# EAGLE design temp_sensor (EAGLE 9.1.3)
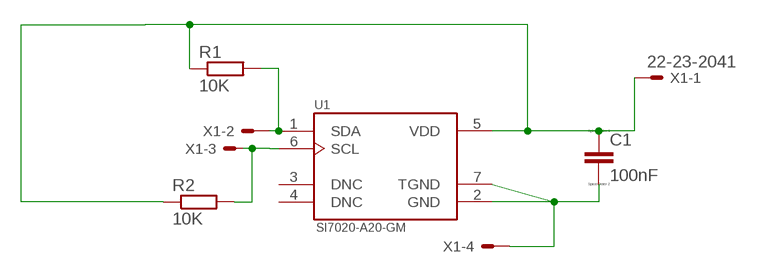
[diagram p0: schematic, sheet 1]

## Parts
C1  100nF  CC0603  [C0603]
R1  10K  R-EU_R0402  [R0402]
R2  10K  R-EU_R0402  [R0402]
U1  SI7020-A20-GM  [SON100P300X300X80-7N]
X1  22-23-2041  [22-23-2041]

## Nets
GND: C1.2 U1.2(GND) U1.7(TGND) X1.4
SCL: R2.2 U1.6(SCL) X1.3
SDA: R1.2 U1.1(SDA) X1.2
VDD: C1.1 R1.1 R2.1 U1.5(VDD) X1.1
Unconnected: U1.3(DNC) U1.4(DNC)

## Library data of the parts
C1 = eagle-ltspice:C: CAPACITOR, European symbol; SPICEMODEL: NONE; SPICEPREFIX: C
R1 R2 = rcl:R-EU_: RESISTOR, European symbol; SPICEPREFIX: R
U1 = SI7020-A20-GM:SI7020-A20-GM: Digital Temperature/Humidity Sensor 6-Pin DFN T/R Check availability <https://pricing.snapeda.com/parts/SI7020-A20-GM/Silicon%20Labs/view-part?ref=eda>; AVAILABILITY: In Stock; DESCRIPTION: Humidity Temperature Sensor 0 ~ 100% RH I²C ±4% RH 18 s Surface Mount; MF: Silicon Labs; MP: SI7020-A20-GM; PACKAGE: DFN-6 Silicon Labs; PRICE: None; PURCHASE-URL: https://pricing.snapeda.com/search/part/SI7020-A20-GM/?ref=eda
X1 = con-molex:22-23-2041: .100" (2.54mm) Center Header - 4 Pin; MF: MOLEX; MPN: 22-23-2041; OC_FARNELL: 1462920; OC_NEWARK: 38C0355

## Board
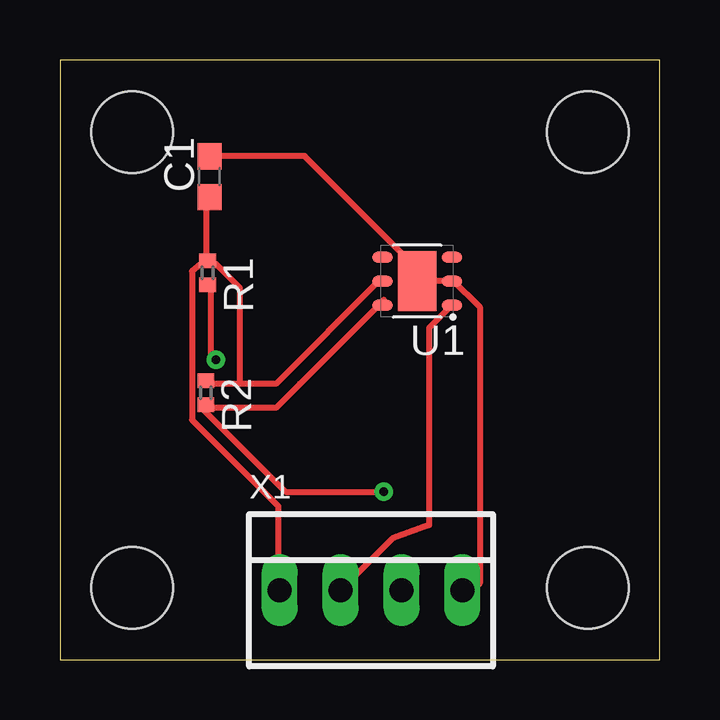
[diagram p1: board, top side]
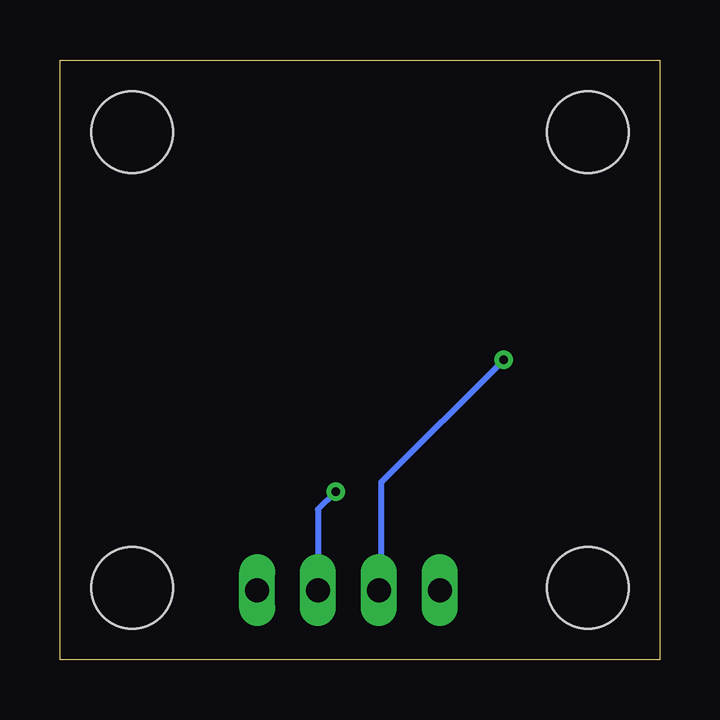
[diagram p2: board, bottom side, seen from below]

Size 25 x 25 mm. Coordinates in mm from the lower left corner, seen from the top.
Outline: 0,0 25,0 25,25 0,25 0,0
Copper layers (1*16): Top 0.035mm / dielectric 1.5mm / Bottom 0.035mm
Design rules "default": minimum track width 6mil, minimum drill 0.35mm, track to track 6mil, track to pad 6mil, pad to pad 6mil, via to via 6mil, smd to smd 6mil, copper to edge 40mil, drill to drill 6mil, minimum pad ring 10mil, minimum via ring 8mil, stop-mask expansion 4mil, vias tented up to drill 0mil, thermal gap 10mil
Holes 3.4 mm at 3,3 3,22 22,22 22,3

### Footprints (pad centres in the part's own frame; a part is rotated, then mirrored left to right if it is on the bottom)
C0603 = smd 1.1 x 1: 1 -0.85,0; 2 0.85,0
R0402 = smd 0.6 x 0.7: 1 -0.5,0; 2 0.5,0
SON100P300X300X80-7N = smd 0.85 x 0.45: 1 -1.45,1; 2 -1.45,0; 3 -1.45,-1; 4 1.45,-1; 5 1.45,0; 6 1.45,1 | smd 1.6 x 2.5: 7 0,0
22-23-2041 = drill 1 long: 1 -3.81,0; 2 -1.27,0; 3 1.27,0; 4 3.81,0

### Placement (x,y rotation side)
C1  6.24,20.13 90 top
R1  6.16,16.13 270 top
R2  6.08,11.13 270 top
U1  14.89,15.78 180 top
X1  12.97,2.89 0 top

### Tracks (layer width: path | path; a pad name or v marks a point on that pad's centre or on a via)
GND
  Top 0.25: 16.37,15.83 17.5,14.7 17.5,3.17 X1.4 | C1.2 6.26,21 10.2,21 15.1,16.1 15.05,16.1 U1.7 14.95,15.8 16.36,15.8 U1.2
SCL  (via drill 0.35)
  Top 0.152: 6,10.5 R2.2 6.03,10.63 5.9,10.5 | 13.5,15 U1.6
  Top 0.25: 6,10.5 9,10.5 10,11.5 13.5,15 | 5.9,10.5 9.4,7 v13.5,7
  Bottom 0.25: X1.3 14.24,6.26 v13.5,7
SDA  (via drill 0.35)
  Top 0.152: 6.3,15.58 R1.2 | v6.5,12.5 6.3,12.7
  Top 0.25: 6.3,12.7 6.3,15.58 | X1.2 13.86,5.05 15.4,5.61 15.4,13.84 U1.1
  Bottom 0.25: v6.5,12.5 11.6,7.4 11.6,2.99 X1.2
VDD
  Top 0.152: 6.5,16.5 R1.1 | 6,11.5 R2.1 | 13.34,15.84 13.35,15.87 U1.5 | 6.5,16.5 R1.1 | C1.1 6.1,19.14 | 6.5,16.5 6.1,16.9 | 6.04,16.63 R1.1
  Top 0.25: 6.1,19.14 6.1,16.9 | 7.5,11.5 9,11.5 13.34,15.84 | 7.5,11.5 6,11.5 | 6.5,16.5 7.5,15.5 7.5,11.5 | 6.04,16.63 5.5,16.19 5.5,10 9.1,6.4 9.1,2.95 X1.1